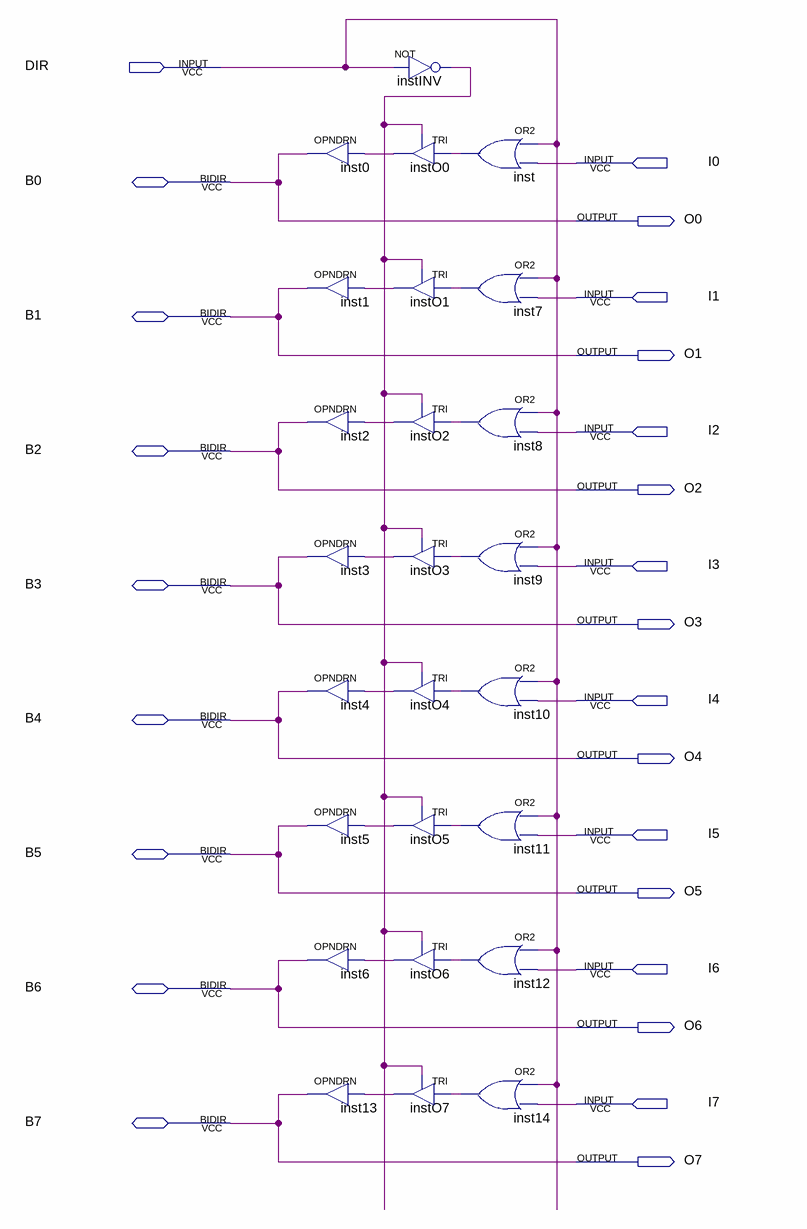
[diagram p0: schematic sheet]
// Quartus schematic 8bidir16_b.bdf as structural Verilog: 25 symbols, 25 pins
module \8bidir16_b  (
  input  DIR,
  input  I0,
  input  I1,
  input  I2,
  input  I3,
  input  I4,
  input  I5,
  input  I6,
  input  I7,
  inout  B0,
  inout  B1,
  inout  B2,
  inout  B3,
  inout  B4,
  inout  B5,
  inout  B6,
  inout  B7,
  output O0,
  output O1,
  output O2,
  output O3,
  output O4,
  output O5,
  output O6,
  output O7
);

  wire inst7_out, inst8_out, inst9_out, inst10_out, inst11_out, inst12_out, inst14_out, inst_out,
       instINV_out, instO0_out, instO1_out, instO2_out, instO3_out, instO4_out, instO5_out, instO6_out,
       instO7_out;

  OPNDRN inst0 (.IN(instO0_out), .OUT(B0));
  OPNDRN inst1 (.IN(instO1_out), .OUT(B1));
  OPNDRN inst2 (.IN(instO2_out), .OUT(B2));
  OPNDRN inst3 (.IN(instO3_out), .OUT(B3));
  OPNDRN inst4 (.IN(instO4_out), .OUT(B4));
  OPNDRN inst5 (.IN(instO5_out), .OUT(B5));
  OPNDRN inst6 (.IN(instO6_out), .OUT(B6));
  OPNDRN inst13 (.IN(instO7_out), .OUT(B7));
  not instINV (instINV_out, DIR);
  TRI instO0 (.IN(inst_out), .OE(instINV_out), .OUT(instO0_out));
  TRI instO1 (.IN(inst7_out), .OE(instINV_out), .OUT(instO1_out));
  TRI instO2 (.IN(inst8_out), .OE(instINV_out), .OUT(instO2_out));
  TRI instO3 (.IN(inst9_out), .OE(instINV_out), .OUT(instO3_out));
  TRI instO4 (.IN(inst10_out), .OE(instINV_out), .OUT(instO4_out));
  TRI instO5 (.IN(inst11_out), .OE(instINV_out), .OUT(instO5_out));
  TRI instO6 (.IN(inst12_out), .OE(instINV_out), .OUT(instO6_out));
  TRI instO7 (.IN(inst14_out), .OE(instINV_out), .OUT(instO7_out));
  or inst (inst_out, DIR, I0);
  or inst7 (inst7_out, DIR, I1);
  or inst8 (inst8_out, DIR, I2);
  or inst9 (inst9_out, DIR, I3);
  or inst10 (inst10_out, DIR, I4);
  or inst11 (inst11_out, DIR, I5);
  or inst12 (inst12_out, DIR, I6);
  or inst14 (inst14_out, DIR, I7);

  assign O0 = B0;
  assign O1 = B1;
  assign O2 = B2;
  assign O3 = B3;
  assign O4 = B4;
  assign O5 = B5;
  assign O6 = B6;
  assign O7 = B7;
endmodule
